# Altium schematic sheet 5-PMU.SchDoc
size A4; DocumentNumber: 5; SheetNumber: 5; SheetTotal: 7
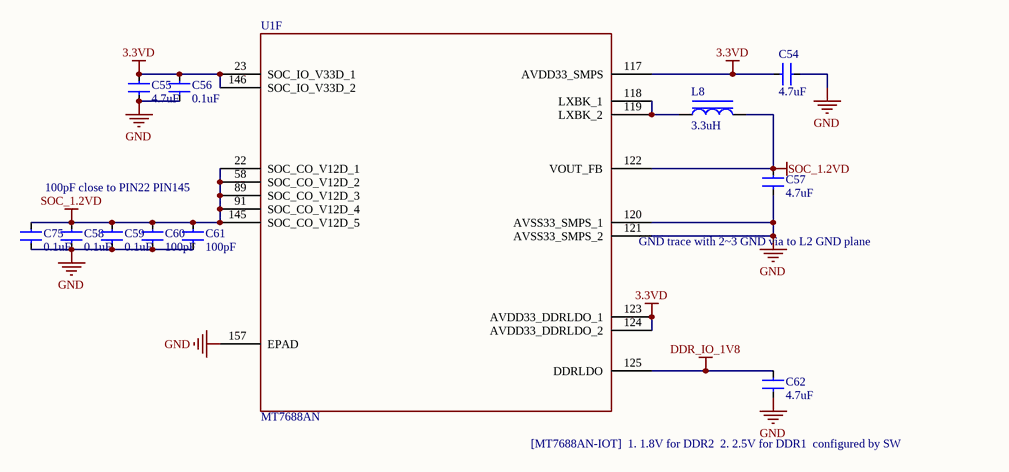
[diagram p0: 5-PMU.SchDoc]

## Parts
C54  4.7uF  [C0402]
C55  4.7uF  [C0402]
C56  0.1uF  [C0402]
C57  4.7uF  [C0402]
C58  0.1uF  [C0402]
C59  0.1uF  [C0402]
C60  100pF  [C0402]
C61  100pF  [C0402]
C62  4.7uF  [C0402]
C75  0.1uF  [C0402]
L8  3.3uH  [VLS3012E]
U1  MT7688AN  [MT7628AN/DRQFN156/SMD/P0.5/12X12]  (part F of 6)

## Nets
3.3VD: C54.1 C55.1 C56.1 U1.23(SOC_IO_V33D_1) U1.117(AVDD33_SMPS) U1.123(AVDD33_DDRLDO_1) U1.124(AVDD33_DDRLDO_2) U1.146(SOC_IO_V33D_2)
DDR_IO_1V8: C62.1 U1.125(DDRLDO)
GND: C54.2 C55.2 C56.2 C57.2 C58.2 C59.2 C60.1 C61.1 C62.2 C75.2 U1.120(AVSS33_SMPS_1) U1.121(AVSS33_SMPS_2) U1.157(EPAD)
SOC_1.2VD: C57.1 C58.1 C59.1 C60.2 C61.2 C75.1 L8.1 U1.22(SOC_CO_V12D_1) U1.58(SOC_CO_V12D_2) U1.89(SOC_CO_V12D_3) U1.91(SOC_CO_V12D_4) U1.122(VOUT_FB) U1.145(SOC_CO_V12D_5)
NetL8_2: L8.2 U1.118(LXBK_1) U1.119(LXBK_2)

## Notes on the sheet
- 100pF close to PIN22 PIN145
- (near U1) GND trace with 2~3 GND via to L2 GND plane
- [MT7688AN-IOT]  1. 1.8V for DDR2  2. 2.5V for DDR1  configured by SW

## Library data of the parts
C54-C62 C75 = CAP: 普通小电容
L8 = L: vls3012小电感